# EAGLE design watch (EAGLE 7.7.0)
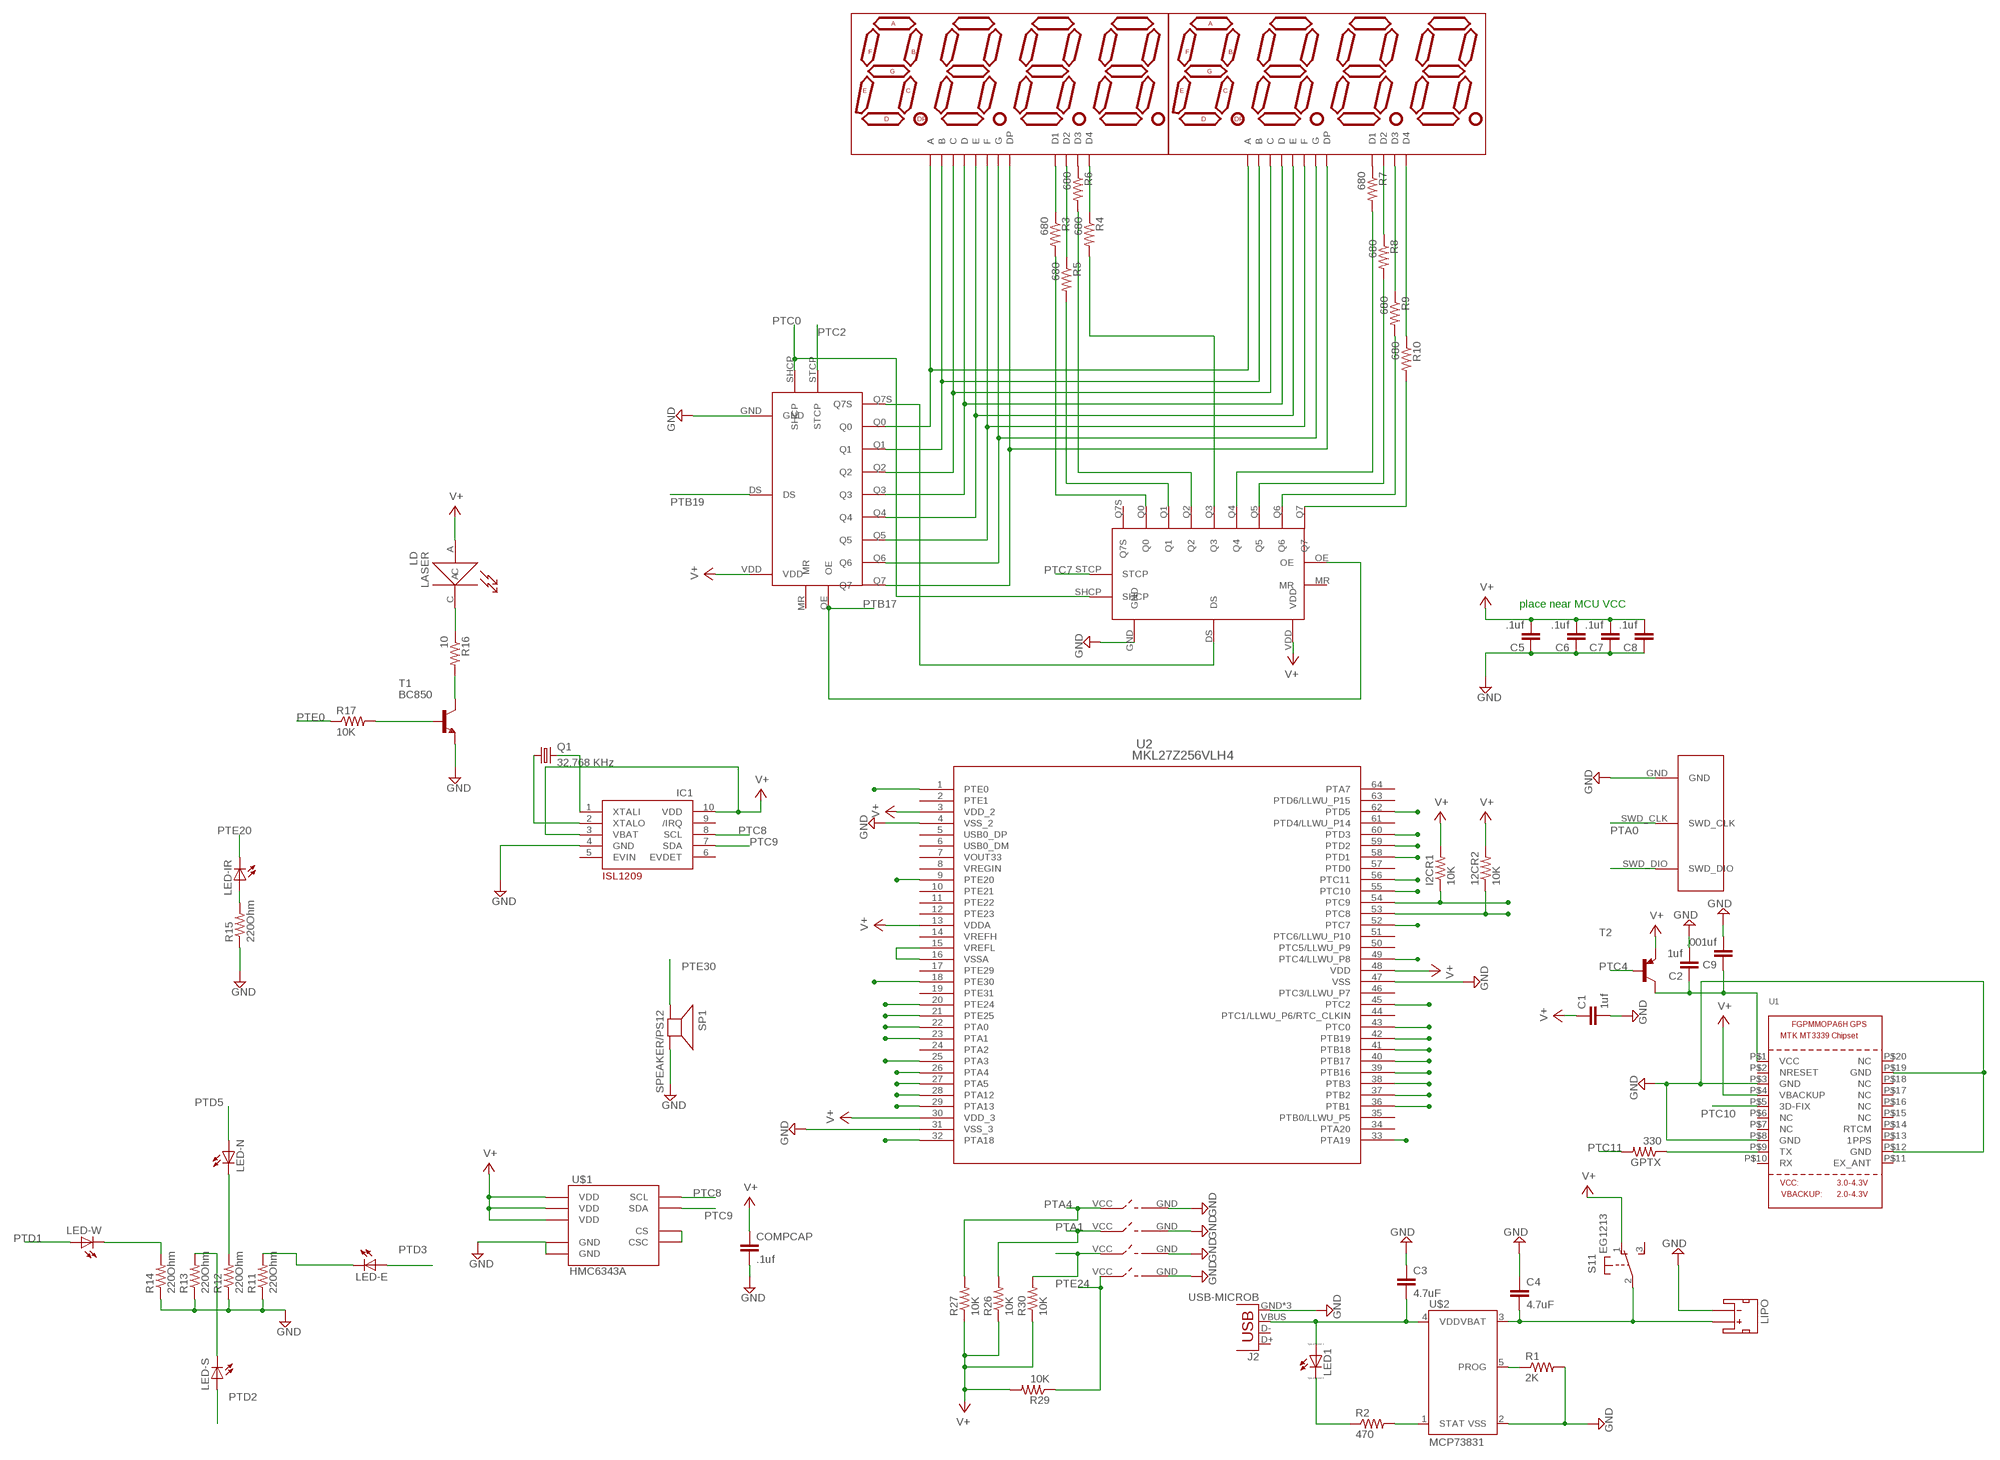
[diagram p0: schematic, sheet 1]

## Parts
12CR2  10K  RESISTOR0603  [0603-RES]
C1  1uf  CAP0603  [0603]
C2  1uf  CAP0603  [0603]
C3  4.7uF  0.1UF-25V(+80/-20%)(0603)  [0603-CAP]
C4  4.7uF  0.1UF-25V(+80/-20%)(0603)  [0603-CAP]
C5  .1uf  CAP0603  [0603]
C6  .1uf  CAP0603  [0603]
C7  .1uf  CAP0603  [0603]
C8  .1uf  CAP0603  [0603]
C9  .001uf  CAP0603  [0603]
COMPCAP  .1uf  CAP0603  [0603]
DISP1  7-SEGMENT-4DIGIT-COUNTER-HP-BUBBLE  [DIL12]
DISP2  7-SEGMENT-4DIGIT-COUNTER-HP-BUBBLE  [DIL12]
GPTX  330  RESISTOR0603  [0603-RES]
I2CR1  10K  RESISTOR0603  [0603-RES]
IC1  ISL1209  [MSOP10]
J2  USB-MICROB  [USB-MICROB]
LASER  LD  [LD-FLUSH-WITH-JUMPER]
LED1  LED_ESML0603  [LED_SML0603]
LED-E  LED5MM  [LED5MM]
LED-IR  LED5MM  [LED5MM]
LED-N  LED5MM  [LED5MM]
LED-S  LED5MM  [LED5MM]
LED-W  LED5MM  [LED5MM]
LIPO  JST_2MM_MALE  [JST-2-SMD]
Q1  32.768 KHz  CRYSTALTC26H  [TC26H]
R1  2K  RESISTOR0603  [0603-RES]
R2  470  RESISTOR0603  [0603-RES]
R3  680  RESISTOR0603  [0603-RES]
R4  680  RESISTOR0603  [0603-RES]
R5  680  RESISTOR0603  [0603-RES]
R6  680  RESISTOR0603  [0603-RES]
R7  680  RESISTOR0603  [0603-RES]
R8  680  RESISTOR0603  [0603-RES]
R9  680  RESISTOR0603  [0603-RES]
R10  680  RESISTOR0603  [0603-RES]
R11  220Ohm  RESISTOR0603  [0603-RES]
R12  220Ohm  RESISTOR0603  [0603-RES]
R13  220Ohm  RESISTOR0603  [0603-RES]
R14  220Ohm  RESISTOR0603  [0603-RES]
R15  220Ohm  RESISTOR0603  [0603-RES]
R16  10  RESISTOR0603  [0603-RES]
R17  10K  RESISTOR0603  [0603-RES]
R26  10K  RESISTOR0603  [0603-RES]
R27  10K  RESISTOR0603  [0603-RES]
R29  10K  RESISTOR0603  [0603-RES]
R30  10K  RESISTOR0603  [0603-RES]
S1  EG1213  [EG1213]
SP1  SPEAKER/PS12  [PS12]
SWD_BREAKOUT  SWD_BREAKOUTS  [SWD]
T1  BC850  [SOT23]
T2  -PNP-SOT23-EBC  [SOT23-EBC]
U1  GPS_FGPMMOPA6H  [FGPMMOPA6H]
U2  MKL27Z256VLH4  [LQFP-64_10X10X1.6]
U$1  HMC6343A  [LCC36]
U$2  MCP73831  [SOT23-5]
U$3  DIPS  [DIPS]
U$4  74HC595PW  [74HC595PW]
U$5  74HC595PW  [74HC595PW]
U$7  DIPS  [DIPS]
U$8  DIPS  [DIPS]
U$9  DIPS  [DIPS]

## Nets
GND: C1.2 C2.2 C3.1 C4.1 C5.1 C6.1 C7.1 C8.1 C9.2 COMPCAP.2 IC1.4(GND) J2.GND J2.MT1(GND) J2.MT2(GND) LIPO.1(-) R1.2 R11.1 R12.1 R13.1 R14.1 R15.1 SP1.P$2(-) SWD_BREAKOUT.GND T1.2(E) U1.P$3(GND) U1.P$8(GND) U1.P$12(GND) U1.P$19(GND) U2.4(VSS_2) U2.31(VSS_3) U2.47(VSS) U$1.25(GND) U$1.29(GND) U$2.2(VSS) U$3.GND U$4.GND U$5.GND U$7.GND U$8.GND U$9.GND
N$1: U$1.22(CS) U$1.35(CSC)
N$2: U2.15(VREFL) U2.16(VSSA)
N$3: C4.2 LIPO.2(+) S1.2(1:P) U$2.3(VBAT)
N$4: C3.2 J2.VBUS LED1.A U$2.4(VDD)
N$5: LED1.C R2.1
N$6: C2.1 C9.1 T2.C U1.P$1(VCC)
N$7: R2.2 U$2.1(STAT)
N$8: R1.1 U$2.5(PROG)
N$9: DISP1.1(D1) R3.1
N$10: DISP1.10(D2) R5.1
N$11: DISP1.12(A) DISP2.12(A) U$4.Q0
N$12: DISP1.4(D3) R6.1
N$13: DISP1.6(D4) R4.1
N$14: DISP2.1(D1) R7.1
N$15: DISP2.10(D2) R8.1
N$16: DISP1.7(G) DISP2.7(G) U$4.Q6
N$17: DISP1.5(DP) DISP2.5(DP) U$4.Q7
N$18: R9.2 U$5.Q6
N$19: DISP1.9(F) DISP2.9(F) U$4.Q5
N$20: DISP2.4(D3) R9.1
N$21: DISP1.8(D) DISP2.8(D) U$4.Q3
N$22: R8.2 U$5.Q5
N$23: R7.2 U$5.Q4
N$24: R4.2 U$5.Q3
N$25: R6.2 U$5.Q2
N$26: DISP2.6(D4) R10.1
N$27: R3.2 U$5.Q0
N$28: U$4.Q7S U$5.DS
N$29: R10.2 U$5.Q7
N$30: GPTX.1 U1.P$9(TX)
N$31: R5.2 U$5.Q1
N$35: LED-N.K(C) R12.2
N$36: LED-E.K(C) R11.2
N$37: LED-W.K(C) R14.2
N$38: LED-S.K(C) R13.2
N$39: LED-IR.A R15.2
N$40: LASER.C R16.1
N$41: R16.2 T1.3(C)
N$42: R17.2 T1.1(B)
N$43: IC1.1(XTALI) Q1.2
N$44: IC1.2(XTALO) Q1.1
N$47: DISP1.2(E) DISP2.2(E) U$4.Q4
N$50: DISP1.11(B) DISP2.11(B) U$4.Q1
N$51: DISP1.3(C) DISP2.3(C) U$4.Q2
PTA0: SWD_BREAKOUT.SWD_CLK U2.22(PTA0)
PTA1: R26.2 U2.23(PTA1) U$7.VCC(V)
PTA3: SWD_BREAKOUT.SWD_DIO U2.25(PTA3)
PTA4: R27.2 U2.26(PTA4) U$3.VCC(V)
PTA5: U2.27(PTA5)
PTA12: U2.28(PTA12)
PTA13: U2.29(PTA13)
PTA18: U2.32(PTA18)
PTA19: U2.33(PTA19)
PTB1: U2.36(PTB1)
PTB2: U2.37(PTB2)
PTB3: U2.38(PTB3)
PTB16: U2.39(PTB16)
PTB17: U2.40(PTB17) U$4.OE U$5.OE
PTB18: U2.41(PTB18)
PTB19: U2.42(PTB19) U$4.DS
PTC0: U2.43(PTC0) U$4.SHCP U$5.SHCP
PTC2: U2.45(PTC2) U$4.STCP
PTC4: T2.B U2.49(PTC4/LLWU_P8)
PTC7: U2.52(PTC7) U$5.STCP
PTC8: 12CR2.1 IC1.8(SCL) U2.53(PTC8) U$1.32(SCL)
PTC9: I2CR1.1 IC1.7(SDA) U2.54(PTC9) U$1.36(SDA)
PTC10: U1.P$5(3D-FIX) U2.55(PTC10)
PTC11: GPTX.2 U2.56(PTC11)
PTD1: LED-W.A U2.58(PTD1)
PTD2: LED-S.A U2.59(PTD2)
PTD3: LED-E.A U2.60(PTD3)
PTD5: LED-N.A U2.62(PTD5)
PTE0: R17.1 U2.1(PTE0)
PTE20: LED-IR.K(C) U2.9(PTE20)
PTE24: R29.1 U2.20(PTE24) U$9.VCC(V)
PTE25: R30.2 U2.21(PTE25) U$8.VCC(V)
PTE30: SP1.P$1(+) U2.18(PTE30)
V+: 12CR2.2 C1.1 C5.2 C6.2 C7.2 C8.2 COMPCAP.1 I2CR1.2 IC1.3(VBAT) IC1.10(VDD) LASER.A R26.1 R27.1 R29.2 R30.1 S1.1(1:O) T2.E U1.P$4(VBACKUP) U2.3(VDD_2) U2.13(VDDA) U2.30(VDD_3) U2.48(VDD) U$1.3(VDD) U$1.11(VDD) U$1.21(VDD) U$4.VDD U$5.VDD
Unconnected: IC1.5(EVIN) IC1.6(EVDET) IC1.9(/IRQ) J2.D+ J2.D- LIPO.NC1(PAD1) LIPO.NC2(PAD2) S1.3(1:S) S1.MT1(MT) S1.MT2(MT) U1.P$2(NRESET) U1.P$6(NC) U1.P$7(NC) U1.P$10(RX) U1.P$11(EX_ANT) U1.P$13(1PPS) U1.P$14(RTCM) U1.P$15(NC) U1.P$16(NC) U1.P$17(NC) U1.P$18(NC) U1.P$20(NC) U2.2(PTE1) U2.5(USB0_DP) U2.6(USB0_DM) U2.7(VOUT33) U2.8(VREGIN) U2.10(PTE21) U2.11(PTE22) U2.12(PTE23) U2.17(PTE29) U2.19(PTE31) U2.24(PTA2) U2.34(PTA20) U2.35(PTB0/LLWU_P5) U2.44(PTC1/LLWU_P6/RTC_CLKIN) U2.46(PTC3/LLWU_P7) U2.50(PTC5/LLWU_P9) U2.51(PTC6/LLWU_P10) U2.57(PTD0) U2.61(PTD4/LLWU_P14) U2.63(PTD6/LLWU_P15) U2.64(PTA7) U$4.MR U$5.MR U$5.Q7S

## Notes on the sheet
- place near MCU VCC

## Power pins joined to a net without a drawn wire
VREFH: U2.14(VREFH)

## Library data of the parts
12CR2 GPTX I2CR1 R1-R17 R26 R27 R29 R30 = SparkFun-Resistors:RESISTOR: Resistor Basic schematic elements and footprints for 0603, 1206, and PTH resistors.
C1 C2 C5-C9 COMPCAP = SparkFun:CAP: Capacitor Standard 0603 ceramic capacitor, and 0.1" leaded capacitor.
C3 C4 = SparkFun-Capacitors:0.1UF-25V(+80/-20%)(0603): CAP-00810 Ceramic Standard decoupling cap; PROD_ID: CAP-00810; VALUE: 0.1uF
DISP1 DISP2 = SparkFun-Displays:7-SEGMENT-4DIGIT-COUNTER; STOREFRONT: COM-12710
IC1 = adafruit:ISL1209: ISL1209 Low Power RTC with Battery Backed SRAM and Event Detection The ISL1209 device is a low power real time clock with event detect function, timing and crystal compensation, clock/calendar, power fail indicator, periodic or polled alarm, intelligent battery backup switching and battery-backed user SRAM.
J2 = SparkFun-Connectors:USB: USB Connectors USB-B-PTH is fully proven SKU : PRT-00139/CONN-08278 USB-miniB is fully proven SKU : PRT-00587 USB-A-PCB is untested. USB-A-H is throughly reviewed, but untested. Spark Fun Electronics SKU : PRT-00437 USB-B-SMT is throughly reviewed, but untested. Needs silkscreen touching up. USB-A-S has not been used/tested USB-MB-H has not been used/tested USB-MICROB has been used. CONN-09505; PROD_ID: CONN-09505
LASER = Photonics:LD
LED1 = eagle-ltspice:LED_E: LED Source: http://www.osram.convergy.de Source: www.luxeon.com Source: www.kingbright.com; SPICEMODEL: NONE; SPICEPREFIX: D; SPICETYPE: diode
LED-E LED-IR LED-N LED-S LED-W = led:LED: LED OSRAM: - CHIPLED LG R971, LG N971, LY N971, LG Q971, LY Q971, LO R971, LY R971 LH N974, LH R974 LS Q976, LO Q976, LY Q976 LO Q996 - Hyper CHIPLED LW Q18S LB Q993, LB Q99A, LB R99A - SideLED LS A670, LO A670, LY A670, LG A670, LP A670 LB A673, LV A673, LT A673, LW A673 LH A674 LY A675 LS A676, LA A676, LO A676, LY A676, LW A676 LS A679, LY A679, LG A679 - Hyper Micro SIDELED® LS Y876, LA Y876, LO Y876, LY Y876 LT Y87S - SmartLED LW L88C, LW L88S LB L89C, LB L89S, LG L890 LS L89K, LO L89K, LY L89K LS L896, LA L896, LO L896, LY L896 - TOPLED LS T670, LO T670, LY T670, LG T670, LP T670 LSG T670, LSP T670, LSY T670, LOP T670, LYG T670 LG T671, LOG T671, LSG T671 LB T673, LV T673, LT T673, LW T673 LH T674 LS T676, LA T676, LO T676, LY T676, LB T676, LH T676, LSB T676, LW T676 LB T67C, LV T67C, LT T67C, LS T67K, LO T67K, LY T67K, LW E67C LS E67B, LA E67B, LO E67B, LY E67B, LB E67C, LV E67C, LT E67C LW T67C LS T679, LY T679, LG T679 LS T770, LO T770, LY T770, LG T770, LP T770 LB T773, LV T773, LT T773, LW T773 LH T774 LS E675, LA E675, LY E675, LS T675 LS T776, LA T776, LO T776, LY T776, LB T776 LHGB T686 LT T68C, LB T68C - Hyper Mini TOPLED® LB M676 - Mini TOPLED Santana® LG M470 LS M47K, LO M47K, LY M47K Source: http://www.osram.convergy.de LUXEON: - LUMILED® LXK2-PW12-R00, LXK2-PW12-S00, LXK2-PW14-U00, LXK2-PW14-V00 LXK2-PM12-R00, LXK2-PM12-S00, LXK2-PM14-U00 LXK2-PE12-Q00, LXK2-PE12-R00, LXK2-PE12-S00, LXK2-PE14-T00, LXK2-PE14-U00 LXK2-PB12-K00, LXK2-PB12-L00, LXK2-PB12-M00, LXK2-PB14-N00, LXK2-PB14-P00, LXK2-PB14-Q00 LXK2-PR12-L00, LXK2-PR12-M00, LXK2-PR14-Q00, LXK2-PR14-R00 LXK2-PD12-Q00, LXK2-PD12-R00, LXK2-PD12-S00 LXK2-PH12-R00, LXK2-PH12-S00 LXK2-PL12-P00, LXK2-PL12-Q00, LXK2-PL12-R00 Source: www.luxeon.com KINGBRIGHT: KA-3528ASYC Source: www.kingbright.com
LIPO = SparkFun-Connectors:JST_2MM_MALE: Mates to single-cell LiPo batteries. CONN-11443 Now with smashable polarity marks!; BTM_NEG: -; BTM_POS: +; PROD_ID: CONN-11443; TOP_NEG: -; TOP_POS: +
Q1 = crystal:CRYSTAL: CRYSTAL; OC_FARNELL: unknown; OC_NEWARK: unknown
S1 = adafruit:EG1213: E-Switch right-angle slide SPDT Part #EG1213 http://www.ladyada.net/library/eagle
SP1 = adafruit:SPEAKER: SPEAKER Source: Buerklin Added PS12 (for part # PS1240 piezo) http://www.ladyada.net/library/pcb/eaglelibrary.html
SWD_BREAKOUT = BOS_libs:SWD_BREAKOUTS
T1 = transistor:BC850: NPN TRANSISTOR
T2 = transistor:*-PNP-: PNP Transistror
U1 = adafruit:GPS_FGPMMOPA6H: GPS Module - MTK MT3339 Chipset, -165dBm sensitivity, 22 channels, 10Hz, auto-select external antenna options
U2 = Freescale:MKL27Z256VLH4; CPU: ARM Cortex-M0+; FLASHKB: 256; MANUFACTURER_PART_NUMBER: mkl27z256vlh4; MAXFREQUENCY: 48; PACKAGE: LQFP; PINCOUNT: 64; SRAMKB: 32; VENDOR: FREESCALE
U$1 = SparkFun:HMC6343
U$2 = GeekAmmo:MCP73831: MCP73831 Miniature Single-Cell, Fully Integrated Li-Ion, Li-Polymer Charge Management Controllers The MCP73831/2 devices are highly advanced linear charge management controllers for use in spacelimited, cost-sensitive applications. http://ww1.microchip.com/downloads/en/DeviceDoc/20001984F.pdf
U$3 U$7-U$9 = BOS_libs:DIPS
U$4 U$5 = BOS_libs:74HC595PW

## Board
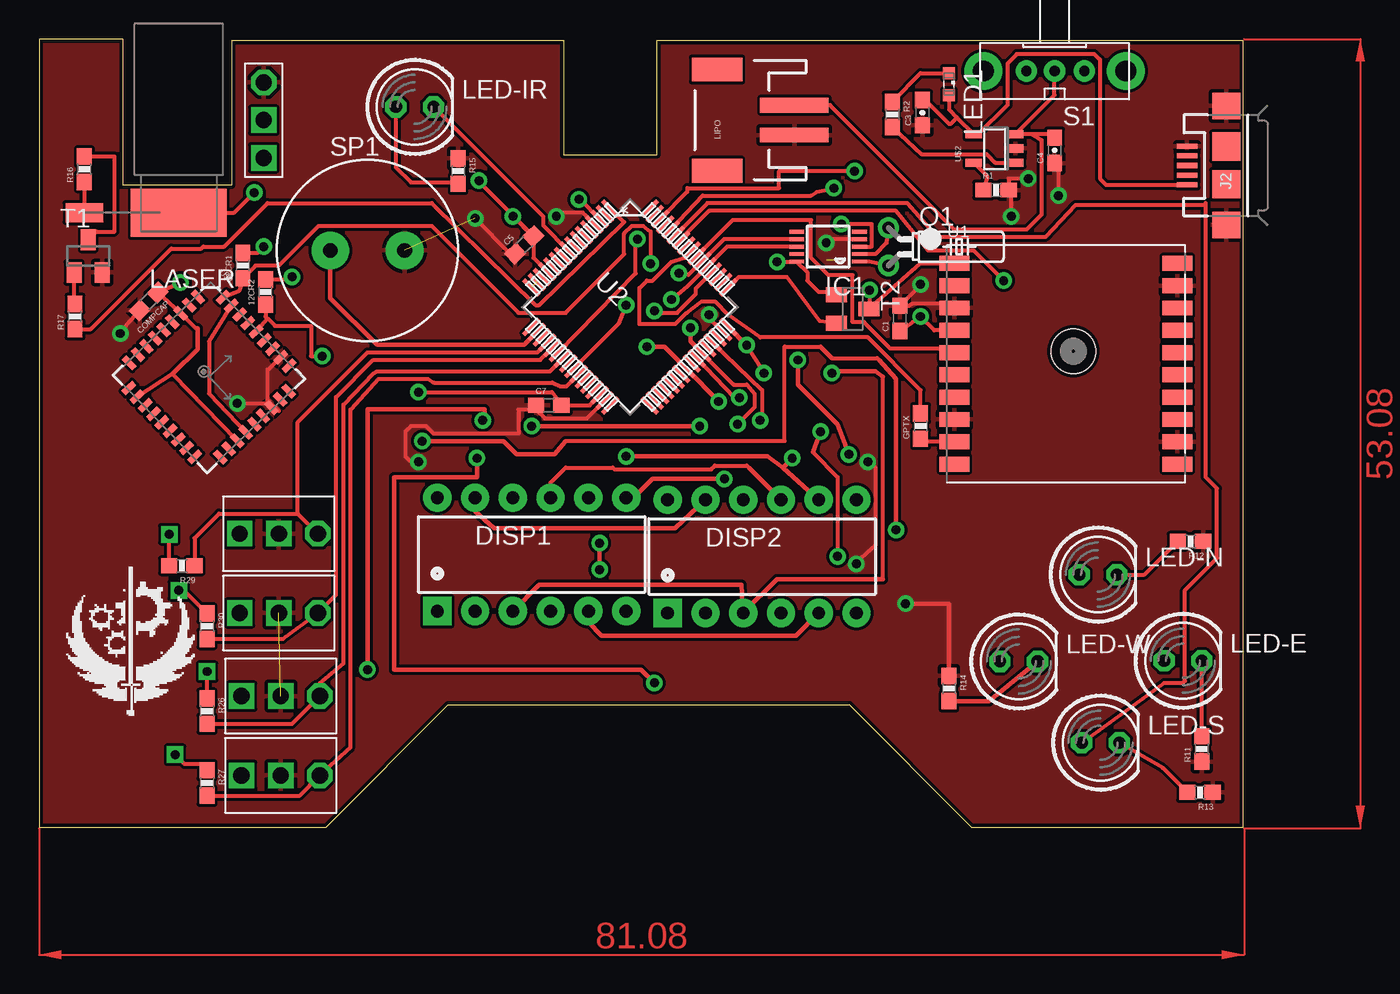
[diagram p1: board, top side]
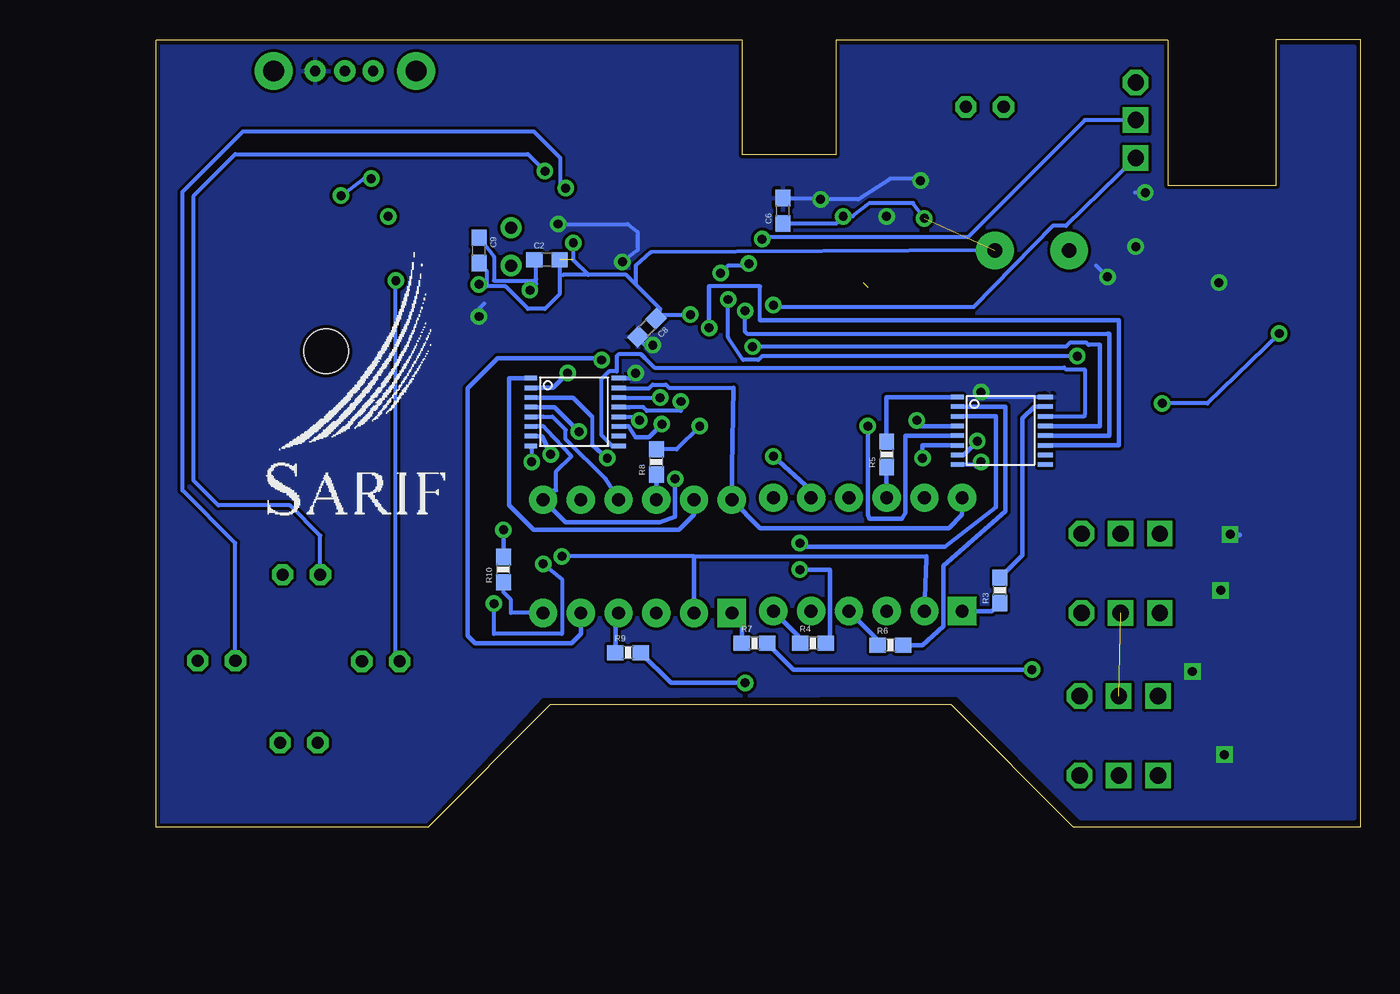
[diagram p2: board, bottom side, seen from below]

Size 81.02 x 53 mm. Coordinates in mm from the lower left corner, seen from the top.
Outline: 0,0 19.3,0 27.51,8.21 54.52,8.21 62.73,0 81.02,0 81.02,52.91 41.57,52.91 41.57,45.21 35.3,45.21 35.3,52.91 12.95,52.91 12.95,43.18 5.67,43.18 5.67,53 0,53 0,0
Copper layers (1*16): Top 0.035mm / dielectric 1.5mm / Bottom 0.035mm
Design rules "SparkFun": minimum track width 8mil, minimum drill 20mil, track to track 8mil, track to pad 8mil, pad to pad 8mil, via to via 8mil, smd to smd 8mil, copper to edge 10mil, drill to drill 8mil, minimum pad ring 12mil, minimum via ring 10mil, stop-mask expansion 4mil, vias tented up to drill 25mil, thermal gap 10mil

### Footprints (pad centres in the part's own frame; a part is rotated, then mirrored left to right if it is on the bottom)
0603-RES = smd 1.1 x 1: 1 -0.85,0; 2 0.85,0
0603 = smd 1.1 x 1: 1 -0.85,0; 2 0.85,0
0603-CAP = smd 1.1 x 1: 1 -0.85,0; 2 0.85,0
DIL12 = drill 0.864 pad 1.905 square: 1 -6.35,-3.81 | drill 0.864 pad 1.905: 2 -3.81,-3.81; 3 -1.27,-3.81; 4 1.27,-3.81; 5 3.81,-3.81; 6 6.35,-3.81; 7 6.35,3.81; 8 3.81,3.81; 9 1.27,3.81; 10 -1.27,3.81; 11 -3.81,3.81; 12 -6.35,3.81
MSOP10 = smd 0.25 x 1: 1 -1,-2.113; 2 -0.5,-2.113; 3 0,-2.113; 4 0.5,-2.113; 5 1,-2.113; 6 1,2.113; 7 0.5,2.113; 8 0,2.113; 9 -0.5,2.113; 10 -1,2.113
USB-MICROB = smd 0.35 x 1.4: D+ 0,2.65; D- -0.65,2.65; GND 1.3,2.65; ID 0.65,2.65; VBUS -1.3,2.65 | smd 1.8 x 1.9: MT1 -4,0; MT2 4,0 | smd 1.9 x 1.9: P$1 -1.27,0; P$2 1.27,0
LD-FLUSH-WITH-JUMPER = smd 6.452 x 3.251: A 0,0 | smd 2.54 x 1.27: C 6.35,0
LED_SML0603 = smd 0.8 x 0.8: A 0.75,0; C -0.75,0
LED5MM = drill 0.813 octagon: A -1.27,0; K 1.27,0
JST-2-SMD = smd 1 x 4.6: 1 -1,-3.7; 2 1,-3.7 | smd 1.6 x 3.4: NC1 -3.4,1.5; NC2 3.4,1.5
TC26H = drill 0.813: 1 -1.27,0; 2 1.27,0
EG1213 = drill 0.7 pad 1.422: 1 -2,0; 2 0,0; 3 1.9,0 | drill 1.4 pad 2.54: MT1 -4.8,0; MT2 4.8,0
PS12 = drill 1 pad 2.54: P$1 -2.5,0; P$2 2.5,0
SWD = drill 1.1 octagon: GND 2.54,0 | drill 1.1 square: SWD_CLK 0,0; SWD_DIO -2.54,0
SOT23 = smd 1 x 1.4: 1 -0.95,-1.1; 2 0.95,-1.1; 3 0,1.1
SOT23-EBC = smd 1 x 1.4: B 0.95,-1.1; C 0,1.1; E -0.95,-1.1
FGPMMOPA6H = smd 2 x 1: P$1 -7.5,6.75; P$2 -7.5,5.25; P$3 -7.5,3.75; P$4 -7.5,2.25; P$5 -7.5,0.75; P$6 -7.5,-0.75; P$7 -7.5,-2.25; P$8 -7.5,-3.75; P$9 -7.5,-5.25; P$10 -7.5,-6.75; P$11 7.5,-6.75; P$12 7.5,-5.25; P$13 7.5,-3.75; P$14 7.5,-2.25; P$15 7.5,-0.75; P$16 7.5,0.75; P$17 7.5,2.25; P$18 7.5,3.75; P$19 7.5,5.25; P$20 7.5,6.75 | hole 3: 0.5,0.85
LQFP-64_10X10X1.6 = smd 1.473 x 0.279: 1 -5.625,3.75; 2 -5.625,3.25; 3 -5.625,2.75; 4 -5.625,2.25; 5 -5.625,1.75; 6 -5.625,1.25; 7 -5.625,0.75; 8 -5.625,0.25; 9 -5.625,-0.25; 10 -5.625,-0.75; 11 -5.625,-1.25; 12 -5.625,-1.75; 13 -5.625,-2.25; 14 -5.625,-2.75; 15 -5.625,-3.25; 16 -5.625,-3.75; 33 5.625,-3.75; 34 5.625,-3.25; 35 5.625,-2.75; 36 5.625,-2.25; 37 5.625,-1.75; 38 5.625,-1.25; 39 5.625,-0.75; 40 5.625,-0.25; 41 5.625,0.25; 42 5.625,0.75; 43 5.625,1.25; 44 5.625,1.75; 45 5.625,2.25; 46 5.625,2.75; 47 5.625,3.25; 48 5.625,3.75 | smd 0.279 x 1.473: 17 -3.75,-5.625; 18 -3.25,-5.625; 19 -2.75,-5.625; 20 -2.25,-5.625; 21 -1.75,-5.625; 22 -1.25,-5.625; 23 -0.75,-5.625; 24 -0.25,-5.625; 25 0.25,-5.625; 26 0.75,-5.625; 27 1.25,-5.625; 28 1.75,-5.625; 29 2.25,-5.625; 30 2.75,-5.625; 31 3.25,-5.625; 32 3.75,-5.625; 49 3.75,5.625; 50 3.25,5.625; 51 2.75,5.625; 52 2.25,5.625; 53 1.75,5.625; 54 1.25,5.625; 55 0.75,5.625; 56 0.25,5.625; 57 -0.25,5.625; 58 -0.75,5.625; 59 -1.25,5.625; 60 -1.75,5.625; 61 -2.25,5.625; 62 -2.75,5.625; 63 -3.25,5.625; 64 -3.75,5.625
LCC36 = smd 1 x 0.42: 1 -4.4,3.2; 2 -4.4,2.4; 3 -4.4,1.6; 4 -4.4,0.8; 5 -4.4,0; 6 -4.4,-0.8; 7 -4.4,-1.6; 8 -4.4,-2.4; 9 -4.4,-3.2; 19 4.4,-3.2; 20 4.4,-2.4; 21 4.4,-1.6; 22 4.4,-0.8; 23 4.4,0; 24 4.4,0.8; 25 4.4,1.6; 26 4.4,2.4; 27 4.4,3.2 | smd 0.42 x 1: 10 -3.2,-4.4; 11 -2.4,-4.4; 12 -1.6,-4.4; 13 -0.8,-4.4; 14 0,-4.4; 15 0.8,-4.4; 16 1.6,-4.4; 17 2.4,-4.4; 18 3.2,-4.4; 28 3.2,4.4; 29 2.4,4.4; 30 1.6,4.4; 31 0.8,4.4; 32 0,4.4; 33 -0.8,4.4; 34 -1.6,4.4; 35 -2.4,4.4; 36 -3.2,4.4
SOT23-5 = smd 0.55 x 1.1: 1 -0.95,-1.3; 2 0,-1.3; 3 0.95,-1.3; 4 0.95,1.5; 5 -0.95,1.5
DIPS = drill 1.1 square: GND 0,0; NC 0,2.635 | drill 1.1 octagon: VCC 0,-2.635
74HC595PW = smd 0.61 x 0.305: DS 3.38,0.65; GND -2.86,-2.6; MR 3.38,-1.95; OE 3.38,0; P$1 -2.6,1.95; P$2 -2.6,1.3; P$3 -2.6,0.65; P$4 -2.6,0; P$5 -2.6,-0.65; P$6 -2.6,-1.3; P$7 -2.6,-1.95; P$8 -2.6,-2.6; P$9 2.99,1.95; P$10 2.99,1.3; P$11 2.99,0.65; P$12 2.99,0; P$13 2.99,-0.65; P$14 2.99,-1.3; P$15 2.99,-1.95; P$16 2.99,-2.6; Q0 3.38,1.3; Q1 -2.86,1.95; Q2 -2.86,1.3; Q3 -2.86,0.65; Q4 -2.86,0; Q5 -2.86,-0.65; Q6 -2.86,-1.3; Q7 -2.86,-1.95; Q7S 3.38,-2.6; SHCP 3.38,-1.3; STCP 3.38,-0.65; VDD 3.38,1.95

### Placement (x,y rotation side)
12CR2  15.24,35.98 90 top
C1  57.91,34.21 90 top
C2  54.74,38.14 0 bottom
C3  59.44,48.05 90 top
C4  68.33,45.51 90 top
C5  32.64,39.16 43.8 top
C6  38.86,41.45 90 bottom
C7  34.29,28.36 0 top
C8  48.01,33.57 225 bottom
C9  59.31,38.78 270 bottom
COMPCAP  7.37,35.35 225 top
DISP1  33.15,18.33 0 top
DISP2  48.64,18.2 0 top
GPTX  59.31,26.97 90 top
I2CR1  13.72,37.76 90 top
IC1  53.09,39.03 90 top
J2  79.88,44.49 90 top
LASER  9.4,41.32 180 top
LED1  61.22,49.95 270 top
LED-E  76.96,11.18 0 top
LED-IR  25.27,48.43 0 top
LED-N  71.25,16.98 0 top
LED-S  71.42,5.67 0 top
LED-W  65.91,11.13 0 top
LIPO  47.12,47.54 90 top
Q1  57.15,39.03 270 top
R1  64.39,42.84 0 top
R2  57.41,47.92 270 top
R3  24.26,15.92 90 bottom
R4  36.83,12.36 0 bottom
R5  31.88,25.06 90 bottom
R6  31.62,12.24 0 bottom
R7  40.77,12.36 0 bottom
R8  47.37,24.55 90 bottom
R9  49.28,11.73 0 bottom
R10  57.66,17.32 90 bottom
R11  78.23,5.25 90 top
R12  77.47,19.22 180 top
R13  78.11,2.33 180 top
R14  61.22,9.31 270 top
R15  28.2,44.11 270 top
R16  3.05,44.24 90 top
R17  2.41,34.33 90 top
R26  11.3,7.79 270 top
R27  11.3,2.96 270 top
R29  9.61,17.57 180 top
R30  11.3,13.51 270 top
S1  68.33,50.84 180 top
SP1  22.1,38.78 0 top
SWD_BREAKOUT  15.11,47.54 90 top
T1  3.3,38.4 0 top
T2  54.74,34.84 270 top
U1  69.09,31.16 0 top
U2  39.75,34.97 315 top
U$1  11.43,30.27 313.9 top
U$2  64.39,45.64 90 top
U$3  16.26,3.47 90 top
U$4  53.09,28.24 0 bottom
U$5  24.39,26.97 0 bottom
U$7  16.26,8.81 90 top
U$8  16.13,14.39 90 top
U$9  16.13,19.73 90 top

### Tracks (layer width: path | path; a pad name or v marks a point on that pad's centre or on a via)
GND  (via drill 0.6)  (3 unrouted)
  Top 0.254: v65.41,41.06 65.41,42.84 R1.2 65.24,43.6 v66.55,43.6 | U1.P$3 60.64,35.22 58.8,35.22 58.51,35.06 C1.2 59.31,36.45 v59.31,36.49 | IC1.4 53.21,39.53 v52.96,39.29 | v55.75,24.55 56.26,24.17 56.26,18.97 54.99,17.82 v54.99,17.7 | v58.29,15.03 58.42,15.16 | 15.5,28.62 16.14,27.97 U$1.25 | COMPCAP.2 5.84,33.7 v5.46,33.19 | v13.34,28.49 15.37,28.49 arc90 15.5,28.62 | U2.4 36.84,41.06 36.83,41.06 36.58,41.32 35.05,41.32 v34.8,41.06 | C5.1 31.7,38.57 v29.34,40.94 | U2.31 36.86,27.48 34.04,27.48 33.44,28.07 | C7.1 33.44,28.07 | 33.44,28.07 32.26,28.07 32.26,26.46 26.54,26.46 26.04,26.97 25.02,26.97 24.64,26.59 24.64,24.94 24.89,24.68 v25.53,24.55 | v45.09,34.46 45.09,34.23 U2.47 | C4.1 68.58,44.66 v68.58,42.46 | 15.5,28.62 15.37,28.62 15.37,30.78 15.45,30.78 U$1.29
  Top 0.305: v25.53,24.55 25.66,24.81 | R14.1 61.22,15.03 v58.29,15.03
  Bottom 0.254: SP1.P$2 47.75,38.65 48.77,37.76 48.77,36.49 | 51.94,37.13 49.4,37.13 48.77,36.49 | 51.94,37.13 53.63,37.13 | v52.96,39.29 52.96,38.14 51.94,37.13 | C2.2 53.89,35.82 54.87,34.84 56.01,34.84 57.53,36.37 58.8,36.37 | 58.8,36.37 59.18,36.37 v59.31,36.49 | U$4.GND 55.75,25.44 v55.75,24.55 | v54.99,17.7 53.72,16.68 53.72,13 58.29,13 v58.29,15.03 | v68.58,42.46 67.06,43.6 v66.55,43.6 | v5.46,33.19 10.29,28.49 v13.34,28.49 | C6.1 35.27,40.6 v34.8,41.06 34.16,41.06 33.02,41.95 30.1,41.95 v29.34,40.94 | C8.1 47.12,34.46 | 47.12,34.46 v45.09,34.46 | 47.12,34.46 47.12,34.84 48.77,36.49 | C9.2 58.8,37.42 58.8,36.37 | 25.84,24.24 25.97,24.37 U$5.GND
  Bottom 0.305: 25.84,24.24 v25.53,24.55
  pour Top: 0.17,52.66 0.17,0.25 1.61,0.25 1.61,0.17 19.05,0.17 27.43,8.55 54.77,8.55 62.9,0.34 80.76,0.34 80.76,52.49 13.29,52.49 13.29,43.01 5.42,43.01 5.42,52.66
N$1
  Top 0.254: U$1.35 11.43,32.65 11.43,29.15 U$1.22
N$2  (1 unrouted)
N$3
  Top 0.254: S1.2 68.33,49.22 U$2.3 66.8,46.59 | C4.2 68.2,46.59 66.8,46.59 | 66.8,46.59 67.44,46.21 67.44,41.19 66.42,40.18 61.6,40.18 53.21,48.56 51.69,48.56 51.67,48.54 LIPO.2
N$4
  Top 0.254: LED1.A 61.22,48.26 61.77,47.71 | 61.77,47.71 U$2.4 63.18,46.59 65.15,48.56 65.15,51.35 65.79,51.99 70.99,51.99 71.38,51.61 71.38,43.6 71.79,43.19 J2.VBUS | C3.2 59.6,48.9 61.22,47.29 61.34,47.29 61.77,47.71
N$5
  Top 0.254: R2.1 59.31,50.7 LED1.C
N$6  (via drill 0.6)
  Top 0.254: U1.P$1 59.29,37.91 T2.C 55.88,35.31 v55.88,36.11
  Bottom 0.254: 55.72,36.28 v55.88,36.11 55.46,36.53 55.46,36.87 | 55.46,36.87 55.46,38.02 C2.1 | C9.1 58.29,38.36 58.29,36.75 55.59,36.75 arc-90 55.46,36.87
N$7
  Top 0.254: R2.2 59.35,45.26 63.76,45.26 64.32,44.69 U$2.1
N$8
  Top 0.254: U$2.5 63.79,43.78 R1.1
N$9
  Bottom 0.305: R3.1 24.81,14.52 DISP1.1
N$10
  Bottom 0.305: DISP1.10 R5.1
N$11
  Bottom 0.254: U$4.Q0 49.68,29.51 47.88,29.51 47.63,29.76 46.74,29.76 46.51,29.54 42.2,29.54
  Bottom 0.305: DISP1.12 26.8,21 27.69,20.11 40.39,20.11 DISP2.12 42.29,24.17 42.2,29.54
N$12
  Bottom 0.305: R6.1 32.47,12.58 DISP1.4
N$13
  Bottom 0.305: R4.1 37.68,12.7 DISP1.6
N$14
  Bottom 0.305: R7.1 41.62,13.72 DISP2.1
N$15
  Bottom 0.305: R8.1 DISP2.10
N$16  (via drill 0.6)
  Top 0.305: DISP1.7 40.01,22.14 41.28,23.41 v46.1,23.41
  Bottom 0.254: DISP2.7 54.36,22.65 54.1,22.65 54.1,23.92 53.09,24.94 54.71,26.68 54.96,26.94 54.99,26.94
  Bottom 0.305: v46.1,23.41 46.1,20.87 47.12,20.49 53.47,20.49 DISP2.7 | 54.99,26.94 U$4.Q6
N$17  (via drill 0.6)
  Top 0.305: DISP1.5 36.96,13.76 37.85,12.87 50.93,12.87 DISP2.5 | v51.06,31.41 51.06,29.76 53.72,27.09 v54.48,25.06
  Bottom 0.305: DISP2.5 52.45,13 53.09,12.36 59.56,12.36 60.07,12.87 60.07,29.51 58.04,31.54 51.18,31.54 v51.06,31.41 | v54.48,25.06 55.07,26.29 U$4.Q7
N$18  (via drill 0.6)
  Top 0.305: v41.4,9.7 40.51,10.58 23.88,10.58 23.88,23.54 29.47,23.54 v29.47,24.81
  Bottom 0.305: R9.2 46.4,9.7 v41.4,9.7 | v29.47,24.81 29.47,25.67 U$5.Q6
N$19
  Top 0.254: 47.75,24.17 47.63,24.3 45.47,24.3 45.21,24.05 38.74,24.05 38.61,24.17 35.43,24.17 34.42,23.16
  Top 0.305: DISP1.9 34.42,23.16 | 47.75,24.17 DISP2.9
  Bottom 0.254: 54.99,27.6 54.36,27.6 53.47,26.71 53.47,26.08 50.8,23.41
  Bottom 0.305: DISP2.9 50.8,23.41 | U$4.Q5 55.93,27.6 54.99,27.6
N$20
  Bottom 0.305: R9.1 50.13,14.18 DISP2.4
N$21  (via drill 0.6)
  Top 0.305: v39.5,24.94 49.02,24.94 50.04,24.17 | 50.04,24.17 DISP2.8 | v50.67,24.81 50.04,24.17
  Bottom 0.254: 51.69,27.6 51.69,25.7
  Bottom 0.305: DISP1.8 36.96,22.65 v39.5,24.94 | U$4.Q3 52.98,28.89 51.69,27.6 | 51.69,25.7 v50.67,24.81
N$22  (via drill 0.6)
  Top 0.305: v33.15,26.97 v44.45,26.97
  Bottom 0.254: v44.45,26.97 46.01,25.4 R8.2
  Bottom 0.305: v33.15,26.97 33.15,21 33.02,20.74 30.86,20.74 30.61,21.13 30.61,23.67 30.62,26.32 U$5.Q5
N$23  (via drill 0.6)
  Top 0.305: v22.1,10.58 22.1,28.11 29.97,28.11 29.97,27.35 v29.85,27.35
  Bottom 0.305: R7.2 38.14,10.58 v22.1,10.58 | U$5.Q4 29.59,26.97 v29.85,27.35
N$24  (via drill 0.6)
  Top 0.305: v37.72,17.32 v37.72,19.09
  Bottom 0.305: U$5.Q3 24.51,27.62 24.51,21.51 27.94,18.84 37.59,18.84 v37.72,19.09 | R4.2 35.69,12.66 35.69,17.32 v37.72,17.32
N$25
  Bottom 0.305: R6.2 29.47,12.24 28.07,13.51 28.07,17.57 23.88,21.25 23.88,28.27 U$5.Q2
N$26
  Bottom 0.254: DISP2.6 57.15,14.39 57.15,15.28 57.66,15.79 R10.1
N$27
  Bottom 0.305: U$5.Q0 21.94,28.27 22.73,27.48 22.73,18.29 R3.2
N$28
  Bottom 0.254: 48.39,31.79 49.91,31.79 50.04,31.67 50.04,30.65 50.55,30.65 51.06,30.14 51.06,26.33 50.36,25.64 U$4.Q7S | 48.13,31.54 47.5,30.9 19.94,30.9 19.81,30.78 18.54,30.78 18.54,27.73 arc90 18.66,27.62 U$5.DS
  Bottom 0.305: 48.13,31.54 48.39,31.79
N$29  (via drill 0.6)
  Top 0.254: 35.43,25.95 50.17,25.95 50.17,32.3 52.58,32.3 | 53.34,31.54 56.39,31.54 56.52,31.41
  Top 0.305: v25.78,25.95 31.24,25.95 32.13,25.06 34.67,25.06 35.43,25.95 | 52.58,32.3 53.34,31.54 | 56.52,31.41 57.66,30.14 v57.66,19.98
  Bottom 0.305: U$5.Q7 26.72,25.02 v25.78,25.95 | v57.66,19.98 R10.2
N$30
  Top 0.254: U1.P$9 59.31,25.91 GPTX.1
N$31
  Bottom 0.305: R5.2 31.88,28.92 U$5.Q1
N$35
  Top 0.254: 76.49,19.35 R12.2 74.38,16.98 LED-N.K
N$36
  Top 0.254: R11.2 LED-E.K
N$37
  Top 0.305: LED-W.K 63.92,8.46 R14.2
N$38
  Top 0.254: LED-S.K 75.61,3.98 R13.2
N$39
  Top 0.254: LED-IR.A 24,44.37 25.02,43.35 28.11,43.35 R15.2
N$40
  Top 0.254: R16.1 LASER.C
N$41
  Top 0.254: T1.3 3.85,40.05 5.08,40.05 5.08,45.09 R16.2
N$42
  Top 0.254: R17.2 2.35,35.24 T1.1
N$43
  Top 0.254: Q1.2 55.87,38.03 IC1.1
N$44
  Top 0.254: IC1.2 56.27,38.53 57.02,39.29 57.15,39.79 Q1.1
N$47  (via drill 0.6)
  Top 0.254: v53.72,18.2 53.72,23.54 52.07,25.19
  Top 0.305: v52.58,26.59 52.07,25.19
  Bottom 0.254: v53.72,18.2 44.83,18.2 29.36,18.2 29.22,18.06
  Bottom 0.305: DISP1.2 29.22,18.06 29.21,18.2 | 44.83,18.2 DISP2.2 | v52.58,26.59 54.23,28.24 U$4.Q4 | v53.72,18.2 53.6,18.08
N$50
  Top 0.305: DISP1.11 29.34,21.25 30.61,20.11 42.8,20.11 DISP2.11
  Bottom 0.305: DISP2.11 44.83,21 45.85,19.98 55.63,19.98 57.28,21.63 57.28,30.19 U$4.Q1
N$51  (via drill 0.6)
  Top 0.254: 56.77,16.68 56.77,30.27
  Top 0.305: DISP1.3 33.66,16.3 47.25,16.3 DISP2.3 49.66,16.68 56.77,16.68 | 56.77,30.27 56.26,30.65 53.47,30.65 v53.34,30.52
  Bottom 0.305: v53.34,30.52 54.33,29.54 U$4.Q2
PTA0  (via drill 0.6)
  Top 0.254: U2.22 40.13,37.24 40.13,39.54 v40.26,39.54
  Bottom 0.254: SWD_BREAKOUT.SWD_CLK 18.54,47.54 26.42,39.67 40.13,39.67 v40.26,39.54
PTA1
  Top 0.254: R26.2 17.03,6.94 U$7.VCC 18.89,9.66 20.49,11.01 20.49,28.41 22.48,30.49 22.73,30.65 34.37,30.65 U2.23
PTA3  (via drill 0.6)
  Top 0.254: v39.5,35.1 38.99,33.85 U2.25
  Bottom 0.254: SWD_BREAKOUT.SWD_DIO 19.81,40.43 20.7,40.43 26.04,34.97 39.37,34.97 v39.5,35.1
PTA4
  Top 0.254: 36.31,30.38 U2.26 35.48,29.63 35.05,29.63 34.55,29.89 26.54,29.89 26.16,30.14 22.86,30.14 20.96,28.07 20.96,5.37 U$3.VCC 17.53,2.11 R27.2
PTB17  (via drill 0.6)
  Top 0.305: v40.9,32.3 42.07,32.3 U2.40 45.75,28.62 v45.72,28.62
  Bottom 0.254: v45.72,28.62 45.72,27.98 48.01,27.98 48.26,28.24 49.15,28.24 | v40.9,32.3 19.81,32.3 19.56,32.56 18.42,32.56 18.29,32.43 17.53,32.43
  Bottom 0.305: U$5.OE 17.53,26.97 17.53,32.43 | 40.9,32.43 v40.9,32.3 | 49.15,28.24 U$4.OE
PTB19  (via drill 0.6)
  Top 0.254: v47.12,28.87 46.78,28.87 U2.42
  Bottom 0.254: U$4.DS 49.69,28.87 v47.12,28.87
PTC0  (via drill 0.6)
  Top 0.254: U2.43 46.73,29.76 47.63,29.76 48.13,29.13 48.13,28.24 v46.99,27.09
  Top 0.305: v43.82,33.57 43.82,32.67 U2.43
  Bottom 0.254: 43.82,36.37 40.39,36.37 40.39,34.08
  Bottom 0.305: U$5.SHCP 16.26,25.67 16.26,34.08 40.39,34.08 | 43.82,36.37 v43.82,33.57 | v46.99,27.09 47.88,26.21 48.77,26.21 49.25,26.94 U$4.SHCP
PTC2  (via drill 0.6)
  Top 0.254: U2.45 48.64,29.38 48.64,27.48 v48.52,27.35
  Bottom 0.254: U$4.STCP 48.88,27.59 v48.52,27.35
PTC4
  Top 0.254: T2.B 52.51,34.02 50.29,37 47.09,37 U2.49
PTC7  (via drill 0.6)
  Top 0.254: v41.4,34.71 41.66,34.59 42.93,34.59 43.44,35.1 44.2,35.85 44.2,36.23 U2.52
  Bottom 0.254: v41.4,34.71 41.4,33.32 41.28,33.19 17.02,33.19 16.89,33.06
  Bottom 0.305: U$5.STCP 16.89,26.32 16.89,33.06 16.89,33.19
PTC8  (via drill 0.6)
  Top 0.254: IC1.8 46.29,39.03 U2.53 43.62,36.37 v42.55,35.48 | 12CR2.1 15.24,34.33 15.37,34.21 | 15.37,34.21 15.88,33.7 | 15.88,33.7 15.87,33.7 | 15.88,33.7 18.29,33.7 18.29,31.67 v19.05,31.67 | U$1.32 15.37,34.21
  Bottom 0.254: v19.05,31.67 40.26,31.67 40.51,31.41 41.53,31.41 42.55,32.94 v42.55,35.48
PTC9  (via drill 0.6)
  Top 0.254: IC1.7 46.08,39.53 U2.54 43.68,37.13 v43.05,37.25 | U$1.36 13.46,36.07 I2CR1.1 14.57,37.76 16.13,37.76 18.8,40.43 26.42,40.43 32.26,34.59 35.43,34.59 39.37,38.52 39.37,39.92 39.88,40.43 40.64,40.43 41.15,40.05 v41.15,37.89
  Bottom 0.254: v41.15,37.89 41.15,37.76 42.55,37.76 v43.05,37.25
PTC10
  Top 0.254: U2.55 46.66,40.81 51.94,40.81 51.94,38.27 53.09,37.13 54.74,37.13 54.74,33.95 55.5,33.95 57.28,32.17 60.58,32.17 61.09,31.67 61.33,31.91 U1.P$5
PTC11
  Top 0.254: GPTX.2 59.31,29.38 55.75,32.94 48.52,32.94 46.36,34.46 45.47,35.35 44.58,35.35 43.56,34.59 42.8,33.83 40.39,33.83 40.39,36.24 40.9,36.75 41.28,36.75 42.55,38.02 43.41,38.27 U2.56
PTD1  (via drill 0.6)
  Top 0.254: U2.58 43.2,39.56 45.09,41.45 57.66,41.45 59.82,38.78 62.87,38.78 v64.9,36.75
  Bottom 0.254: LED-W.A 64.9,11.73 v64.9,36.75
PTD2
  Top 0.254: LED-S.A 75.69,9.7 76.96,9.7 77.09,9.82 77.09,15.92 79.25,18.08 79.25,22.78 78.49,23.54 78.49,41.95 78.36,41.83 69.72,41.83 67.69,39.67 60.45,39.67 58.42,41.95 44.96,41.95 44.96,41.94 U2.59 42.85,39.97
PTD3  (via drill 0.6)
  Top 0.254: U2.60 44.64,42.46 51.94,42.46 52.33,42.72 v53.47,42.97
  Bottom 0.254: LED-E.A 75.69,19.09 79.25,22.65 79.25,42.72 75.19,46.78 55.63,46.78 53.85,45 53.85,42.72 v53.47,42.97
PTD5  (via drill 0.6)
  Top 0.254: v54.87,44.11 49.79,44.11 49.79,42.97 43.61,42.97 43.61,42.72 U2.62
  Bottom 0.254: LED-N.A 69.98,19.6 72.01,21.63 76.84,21.63 78.49,23.28 78.49,42.46 75.69,45.26 56.01,45.26 v54.87,44.11
PTE0
  Top 0.254: U2.1 39.34,40.68 39.37,40.68 33.66,35.1 33.4,35.1 26.42,41.95 15.37,41.95 12.45,39.03 11.05,39.03 10.92,38.91 8.89,38.91 3.47,33.48 R17.1
PTE20
  Top 0.254: LED-IR.K 33.91,41.06 33.91,40.46 U2.9
PTE24
  Top 0.254: U2.20 33.52,31.92 22.1,31.92 17.41,27.23 17.41,21.08 | 17.41,21.08 12.11,21.08 10.46,19.43 R29.1 | 17.41,21.08 U$9.VCC
PTE25
  Top 0.254: R30.2 16.39,12.66 U$8.VCC 19.98,15.61 19.98,28.91 22.48,31.41 33.72,31.41 U2.21
PTE30
  Top 0.305: U2.18 32.62,32.43 22.73,32.43 19.6,35.56 SP1.P$1
V+  (via drill 0.6)
  Top 0.254: U1.P$4 60.24,33.41 v59.31,34.33 58.76,33.95 C1.1 | IC1.3 56.01,39.03 56.01,40.56 v53.98,40.56 | v49.66,38.02 50.96,38.02 IC1.10 51.69,37.32 51.69,36.75 52.45,35.98 53.95,35.98 T2.E | 12CR2.2 16.85,36.83 v17.02,37 | U$1.21 9.04,30.41 9.04,30.5 | I2CR1.2 14.69,38.61 v15.11,39.03 | C5.2 33.25,38.29 U2.13 | C5.2 33.2,39.75 v31.88,41.06 | v36.32,42.21 36.4,42.21 U2.3 | C5.2 29.59,43.41 v29.59,43.48 | U2.30 37.04,28.36 C7.2 34.51,29.25 v25.53,29.25 | R27.1 11.3,4.23 9.78,4.23 v9.15,4.87 | R29.2 v8.76,19.69 | R30.1 9.74,15.92 v9.4,15.92 | R26.1 v11.3,10.46 | v9.53,36.62 COMPCAP.1 U$1.3 10.54,33.54 10.67,33.54 | LASER.A 13.13,41.32 v14.48,42.67
  Top 0.305: U2.48 v47.61,32.41 48.52,31 v48.77,30.52 | 10.67,33.54 10.67,32.13 9.04,30.5 U$1.11
  Bottom 0.254: v59.31,34.33 59.31,34.84 58.93,35.22 | v53.98,40.56 49.28,40.56 48.64,40.05 48.64,38.78 v49.66,38.02 | v17.02,37 17.78,37.76 | v15.11,39.03 15.11,39.16 15.37,39.41 | v31.88,41.06 31.62,41.32 | C6.2 36.41,42.3 v36.32,42.21 33.78,42.21 31.62,43.6 29.72,43.6 v29.59,43.48 | C8.2 48.61,32.9 48.12,32.41 v47.61,32.41 | 20.96,28.92 U$5.VDD 25.53,28.92 v25.53,29.25 | 8.13,19.69 8.13,19.6 | v9.4,15.92 9.27,16.05 9.15,16.05 | v11.3,10.46 11.3,10.84 | v9.15,4.87 8.89,5.12 | v14.48,42.67 15.15,42.67
  Bottom 0.305: U$4.VDD 48.81,30.19 v48.77,30.52
  pour Bottom: 0.42,52.49 0.42,0.59 18.79,0.59 27.09,8.89 55.11,8.8 62.9,0.34 80.76,0.34 80.76,52.49 13.29,52.49 13.29,43.01 5.33,43.01 5.33,52.49
(copper drawn outside any net)
  shapes: Top area x2